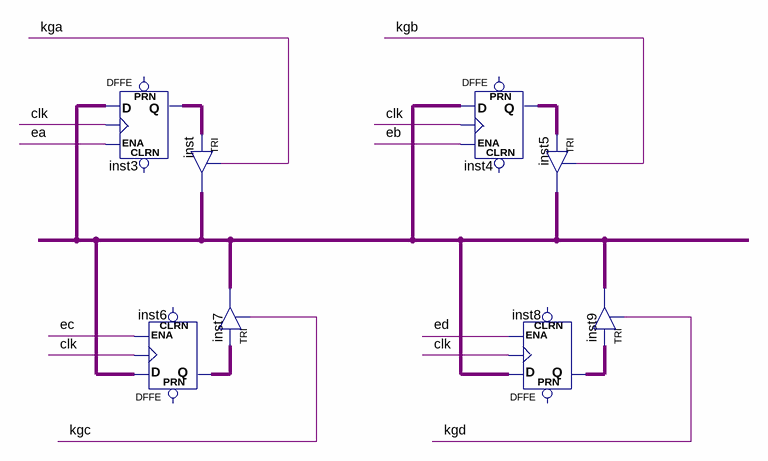
[diagram p0: schematic sheet]
// Quartus schematic jcqbus4.bdf as structural Verilog: 8 symbols, 0 pins
module jcqbus4 (
);

  wire clk, ea, eb, ec, ed, inst3_q, inst4_q, inst6_q, inst8_q, inst_out, kga, kgb, kgc, kgd;

  DFFE inst3 (.D(inst_out), .CLK(clk), .ENA(ea), .Q(inst3_q));  // open: PRN, CLRN
  DFFE inst6 (.D(inst_out), .CLK(clk), .ENA(ec), .Q(inst6_q));  // open: PRN, CLRN
  TRI inst (.IN(inst3_q), .OE(kga), .OUT(inst_out));
  TRI inst7 (.IN(inst6_q), .OE(kgc), .OUT(inst_out));
  DFFE inst4 (.D(inst_out), .CLK(clk), .ENA(eb), .Q(inst4_q));  // open: PRN, CLRN
  TRI inst5 (.IN(inst4_q), .OE(kgb), .OUT(inst_out));
  DFFE inst8 (.D(inst_out), .CLK(clk), .ENA(ed), .Q(inst8_q));  // open: PRN, CLRN
  TRI inst9 (.IN(inst8_q), .OE(kgd), .OUT(inst_out));
endmodule
